# EasyEDA Pro project bldc-high-current-2-easyeda.epro, schematic Schematic1

## Sheets
1 power stage: Board Name: Board1; Create Date: 2025-10-15; Page Name: power stage; Project Name: bldc-high-current-2-easyeda; Schematic Name: Schematic1; Update Date: 2025-10-23; Company: EasyEDA.com; Page Size: A4; Version: V1.0
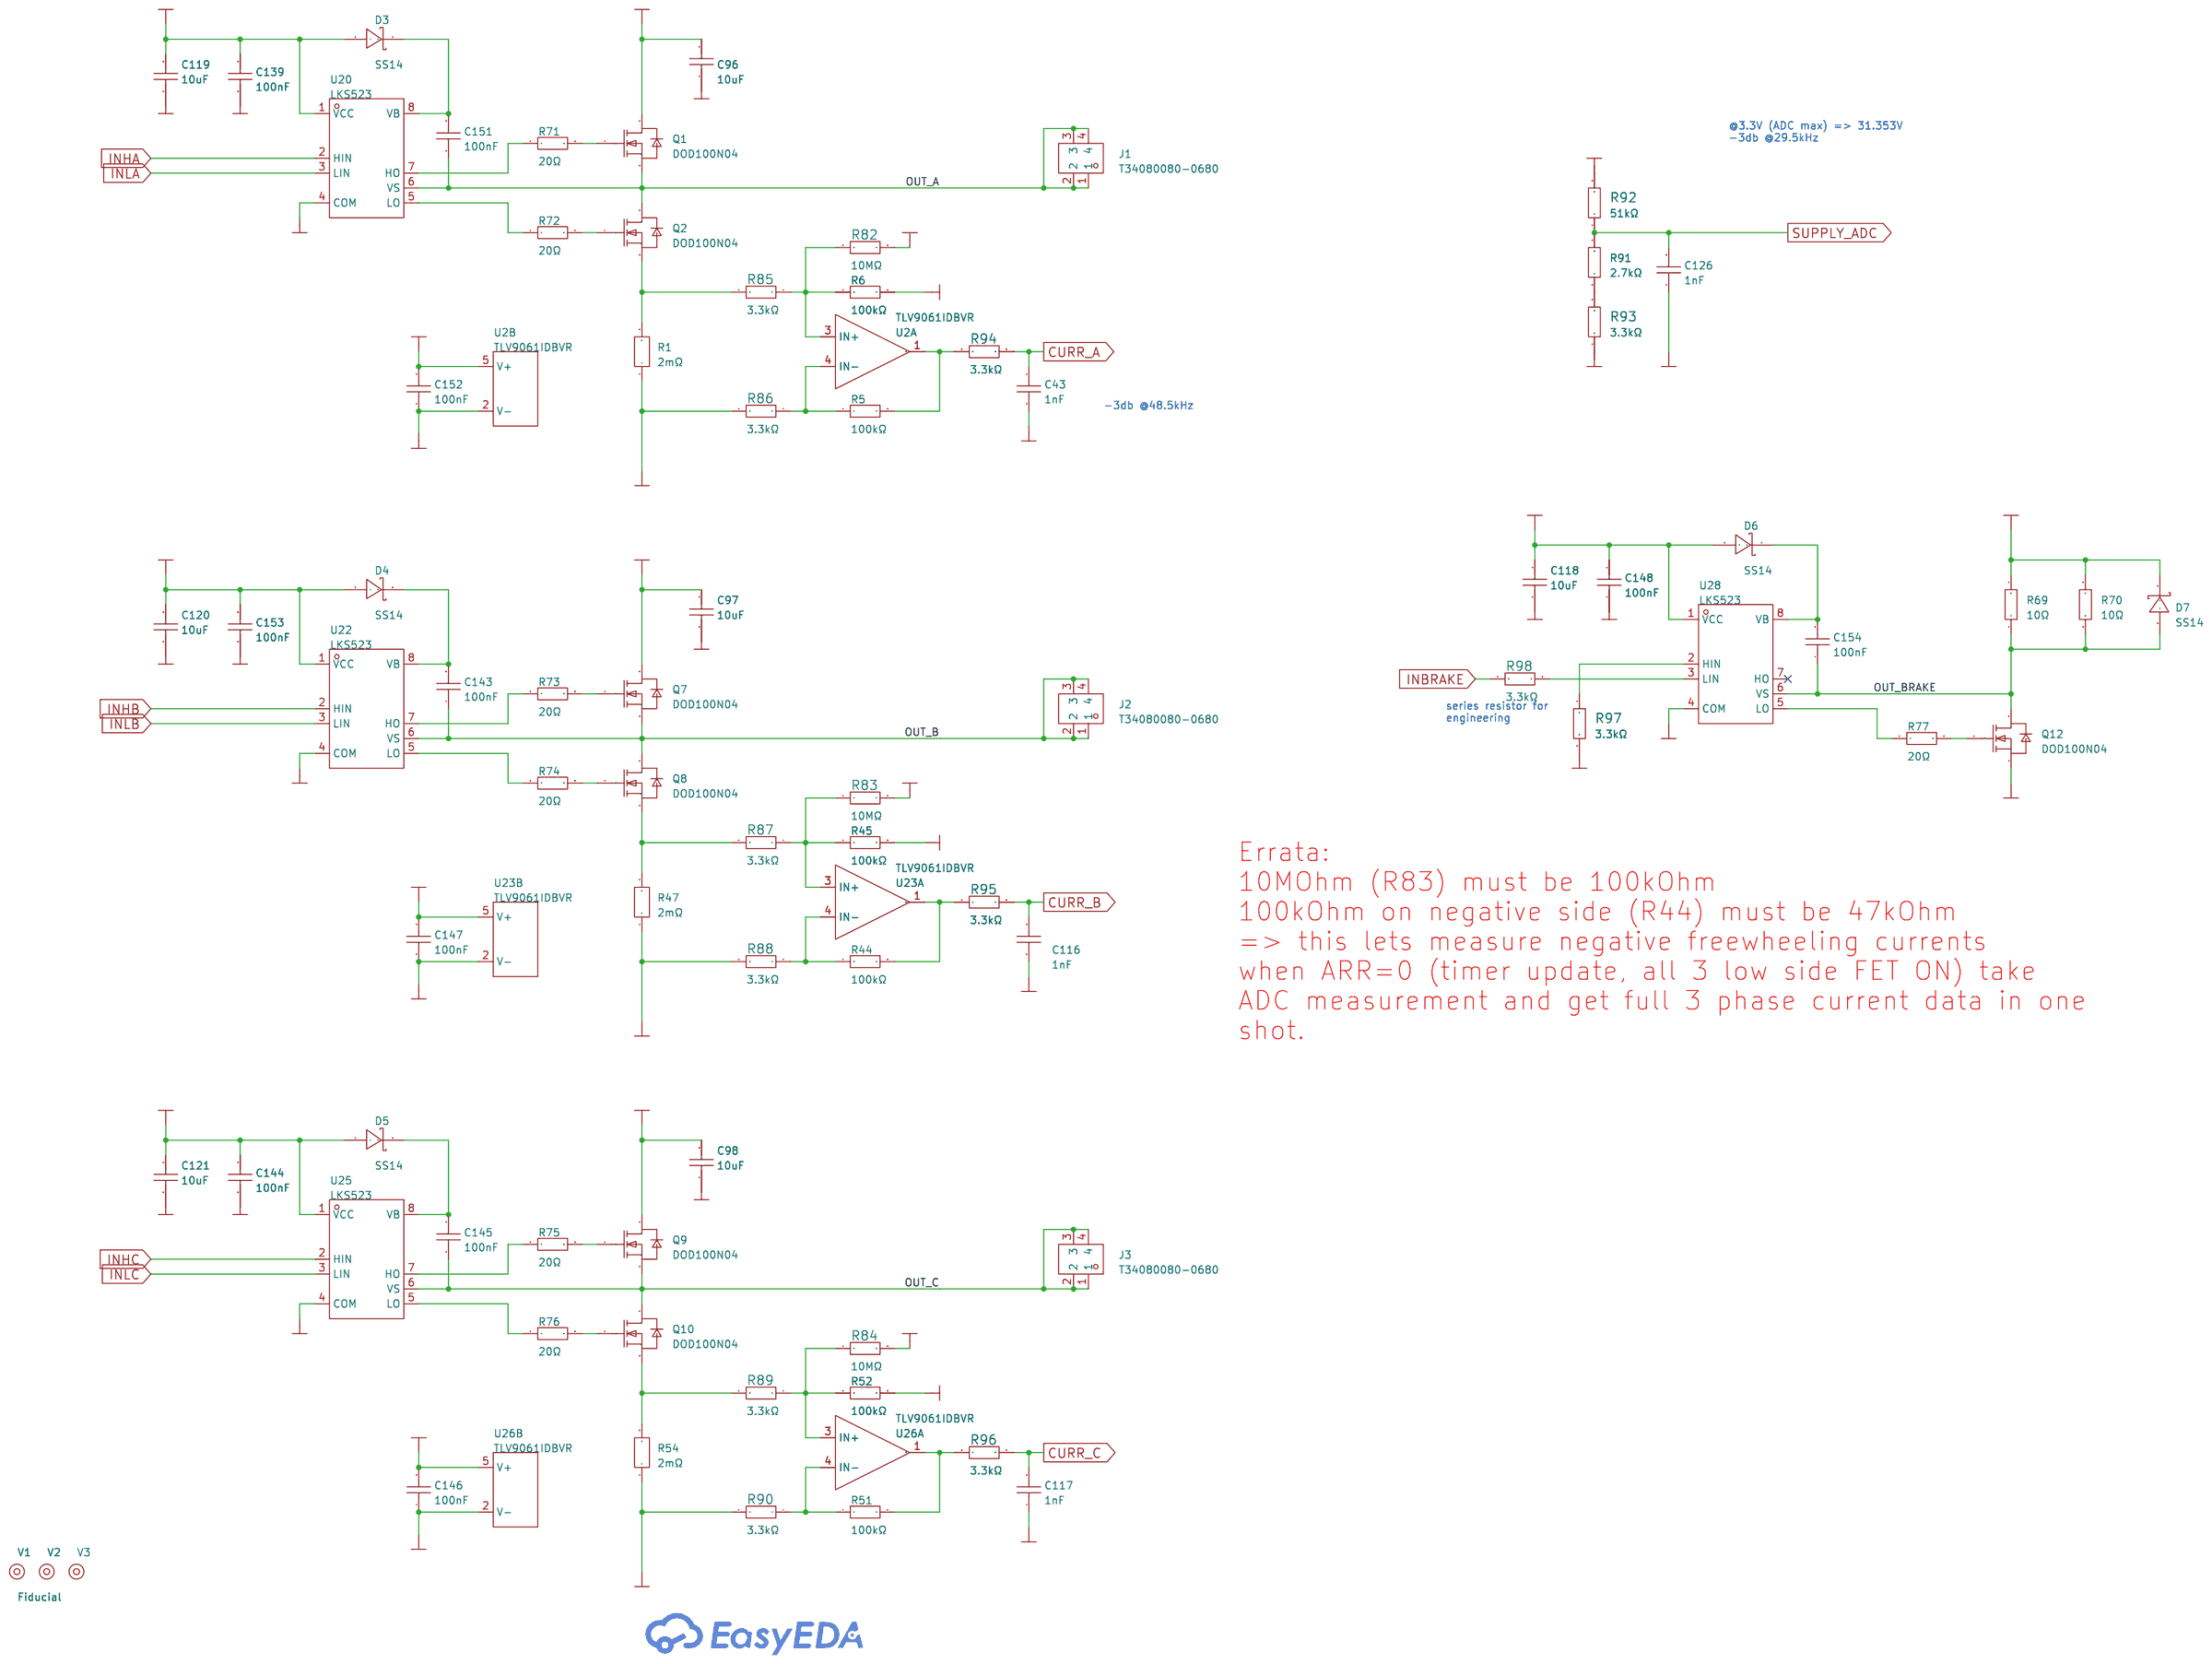
[diagram p0: power stage]
2 supply: Page Name: supply; Update Date: 2025-10-16
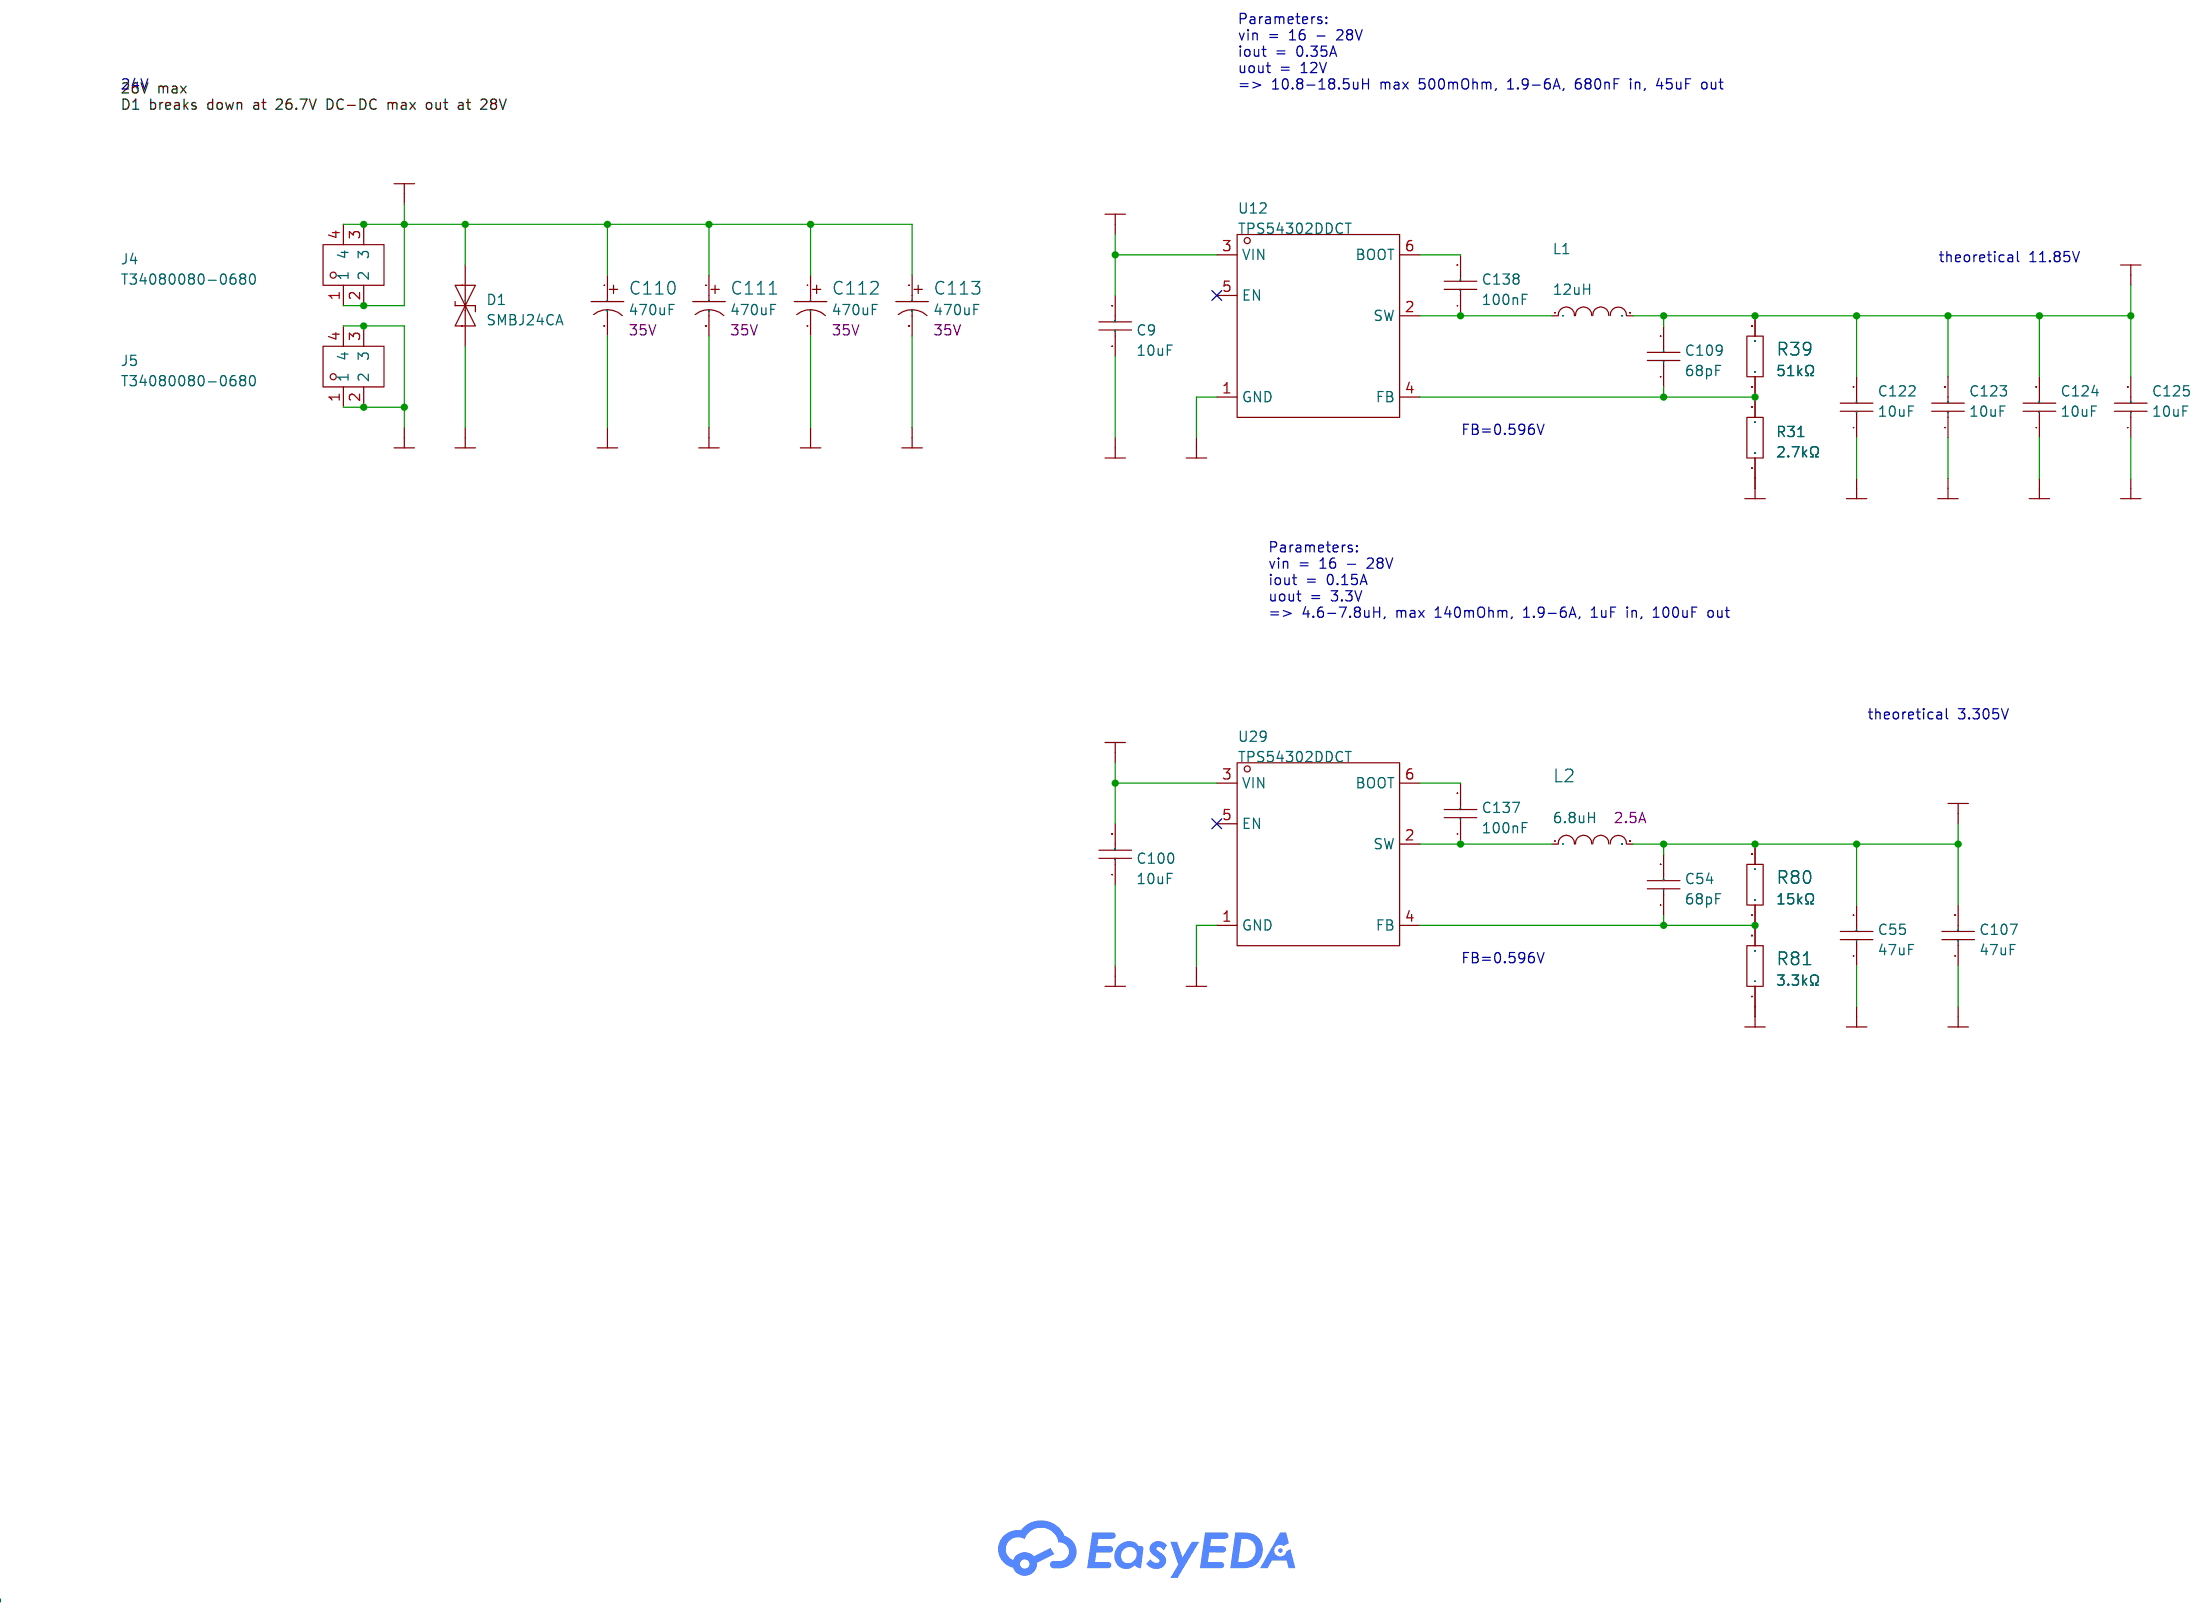
[diagram p1: supply]
3 controller: Page Name: controller; Update Date: 2025-10-16
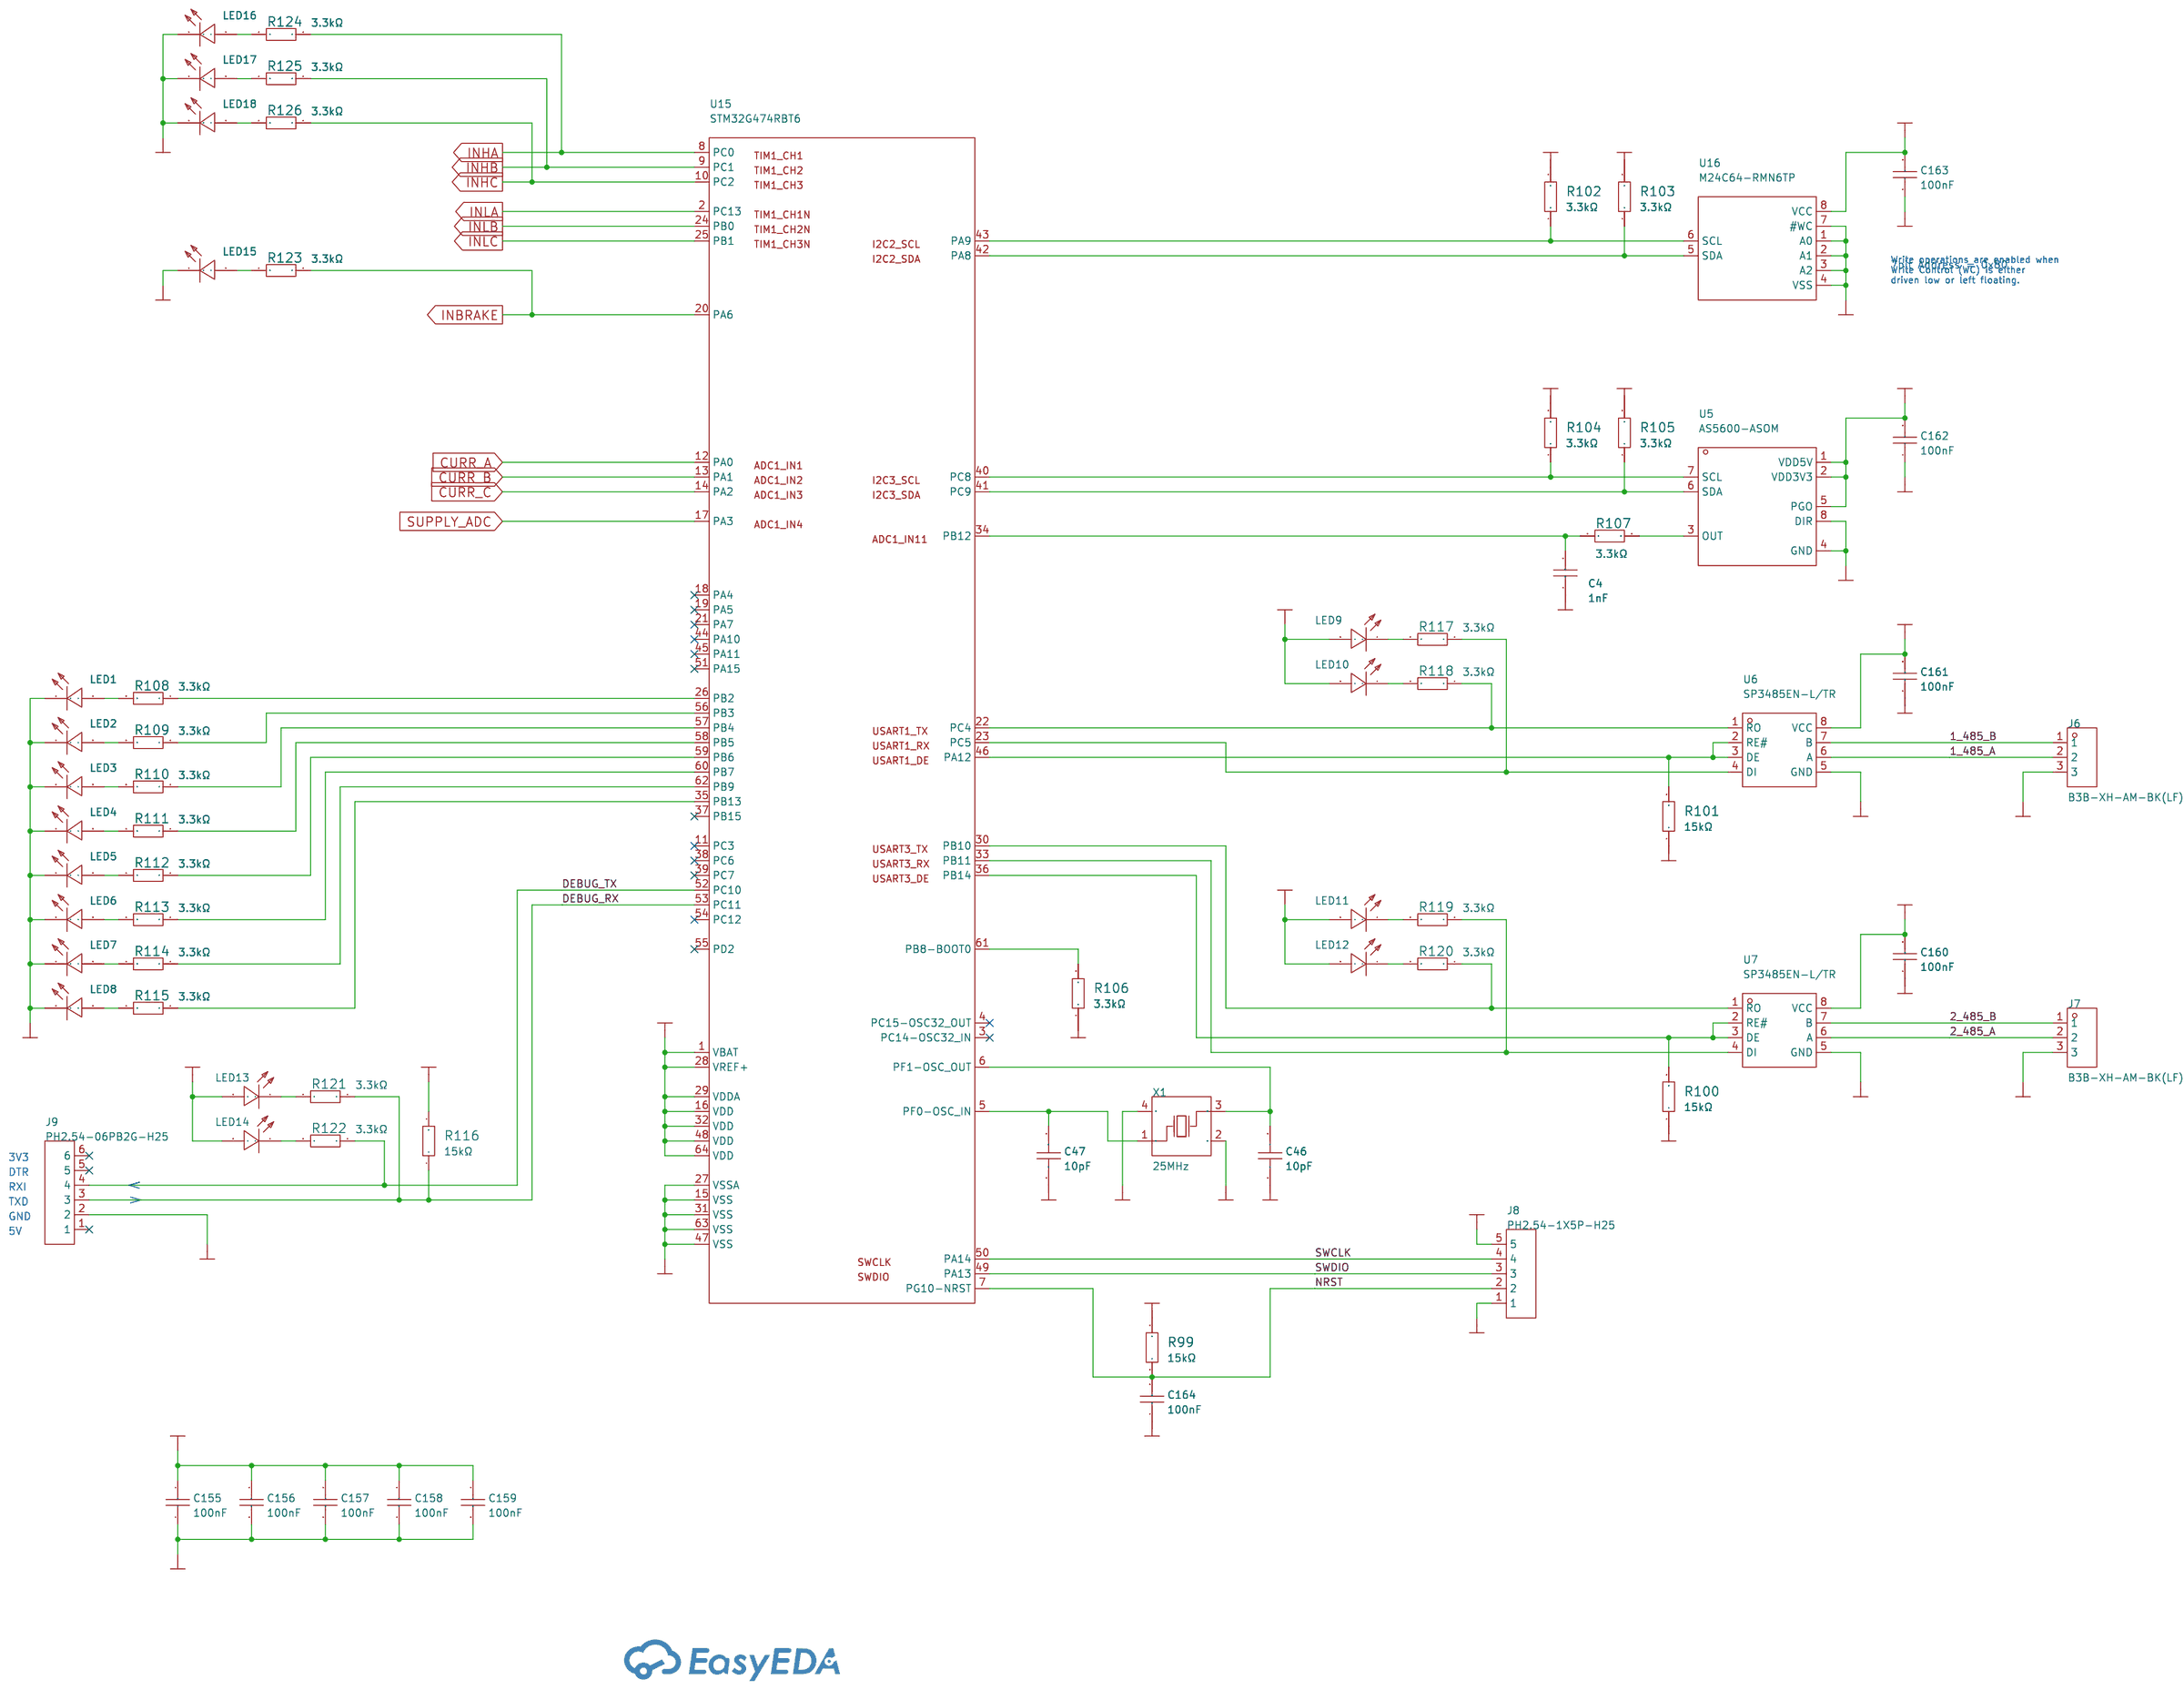
[diagram p2: controller]

## Parts
sheet controller
C4  1nF  [C0402]
C46  10pF  [C0402]
C47  10pF  [C0402]
C155  100nF  [C0402]
C156  100nF  [C0402]
C157  100nF  [C0402]
C158  100nF  [C0402]
C159  100nF  [C0402]
C160  100nF  [C0402]
C161  100nF  [C0402]
C162  100nF  [C0402]
C163  100nF  [C0402]
C164  100nF  [C0402]
J6  B3B-XH-AM-BK(LF)(SN)  [CONN-TH_B3B-XH-AM-BK-LF-SN]
J7  B3B-XH-AM-BK(LF)(SN)  [CONN-TH_B3B-XH-AM-BK-LF-SN]
J8  PH2.54-1X5P-H25  [HDR-TH_5P-P2.54-V-M-3]  (no BOM)
J9  PH2.54-06PB2G-H25  [HDR-TH_6P-P2.54-V-M_BLUE]  (no BOM)
LED1  KT-0603R  [LED0603-RD]
LED2  KT-0603R  [LED0603-RD]
LED3  KT-0603R  [LED0603-RD]
LED4  KT-0603R  [LED0603-RD]
LED5  KT-0603R  [LED0603-RD]
LED6  KT-0603R  [LED0603-RD]
LED7  KT-0603R  [LED0603-RD]
LED8  KT-0603R  [LED0603-RD]
LED9  KT-0603R  [LED0603-RD]
LED10  KT-0603R  [LED0603-RD]
LED11  KT-0603R  [LED0603-RD]
LED12  KT-0603R  [LED0603-RD]
LED13  KT-0603R  [LED0603-RD]
LED14  KT-0603R  [LED0603-RD]
LED15  KT-0603R  [LED0603-RD]
LED16  KT-0603R  [LED0603-RD]
LED17  KT-0603R  [LED0603-RD]
LED18  KT-0603R  [LED0603-RD]
R99  15kΩ  [R0402]
R100  15kΩ  [R0402]
R101  15kΩ  [R0402]
R102  3.3kΩ  [R0402]
R103  3.3kΩ  [R0402]
R104  3.3kΩ  [R0402]
R105  3.3kΩ  [R0402]
R106  3.3kΩ  [R0402]
R107  3.3kΩ  [R0402]
R108  3.3kΩ  [R0402]
R109  3.3kΩ  [R0402]
R110  3.3kΩ  [R0402]
R111  3.3kΩ  [R0402]
R112  3.3kΩ  [R0402]
R113  3.3kΩ  [R0402]
R114  3.3kΩ  [R0402]
R115  3.3kΩ  [R0402]
R116  15kΩ  [R0402]
R117  3.3kΩ  [R0402]
R118  3.3kΩ  [R0402]
R119  3.3kΩ  [R0402]
R120  3.3kΩ  [R0402]
R121  3.3kΩ  [R0402]
R122  3.3kΩ  [R0402]
R123  3.3kΩ  [R0402]
R124  3.3kΩ  [R0402]
R125  3.3kΩ  [R0402]
R126  3.3kΩ  [R0402]
U5  AS5600-ASOM  [SOIC-8_L5.0-W4.0-P1.27-LS6.0-BL]
U6  SP3485EN-L/TR  [SOIC-8_L5.0-W4.0-P1.27-LS6.0-BL]
U7  SP3485EN-L/TR  [SOIC-8_L5.0-W4.0-P1.27-LS6.0-BL]
U15  STM32G474RBT6  [LQFP-64_L10.0-W10.0-P0.50-LS12.0-BL]
U16  M24C64-RMN6TP  [SOIC-8_L5.0-W4.0-P1.27-LS6.0-BL]
X1  25MHz  [CRYSTAL-SMD_4P-L3.2-W2.5-BL]
sheet power stage
C43  1nF  [C0402]
C96  10uF  [C1206]
C97  10uF  [C1206]
C98  10uF  [C1206]
C116  1nF  [C0402]
C117  1nF  [C0402]
C118  10uF  [C0805]
C119  10uF  [C0805]
C120  10uF  [C0805]
C121  10uF  [C0805]
C126  1nF  [C0402]
C139  100nF  [C0402]
C143  100nF  [C0402]
C144  100nF  [C0402]
C145  100nF  [C0402]
C146  100nF  [C0402]
C147  100nF  [C0402]
C148  100nF  [C0402]
C151  100nF  [C0402]
C152  100nF  [C0402]
C153  100nF  [C0402]
C154  100nF  [C0402]
D3  SS14  [SMA_L4.2-W2.6-LS5.0-RD_1]
D4  SS14  [SMA_L4.2-W2.6-LS5.0-RD_1]
D5  SS14  [SMA_L4.2-W2.6-LS5.0-RD_1]
D6  SS14  [SMA_L4.2-W2.6-LS5.0-RD_1]
D7  SS14  [SMA_L4.2-W2.6-LS5.0-RD_1]
J1  T34080080-0680  [CONN-TH_T34080080-0680]
J2  T34080080-0680  [CONN-TH_T34080080-0680]
J3  T34080080-0680  [CONN-TH_T34080080-0680]
Q1  DOD100N04  [TO-252-2_L6.6-W6.2-P4.57-LS10.1-BR-CW]
Q2  DOD100N04  [TO-252-2_L6.6-W6.2-P4.57-LS10.1-BR-CW]
Q7  DOD100N04  [TO-252-2_L6.6-W6.2-P4.57-LS10.1-BR-CW]
Q8  DOD100N04  [TO-252-2_L6.6-W6.2-P4.57-LS10.1-BR-CW]
Q9  DOD100N04  [TO-252-2_L6.6-W6.2-P4.57-LS10.1-BR-CW]
Q10  DOD100N04  [TO-252-2_L6.6-W6.2-P4.57-LS10.1-BR-CW]
Q12  DOD100N04  [TO-252-2_L6.6-W6.2-P4.57-LS10.1-BR-CW]
R1  2mΩ  [RES-SMD_L6.4-W3.2-1]
R5  100kΩ  [R0603]
R6  100kΩ  [R0603]
R44  100kΩ  [R0603]
R45  100kΩ  [R0603]
R47  2mΩ  [RES-SMD_L6.4-W3.2-1]
R51  100kΩ  [R0603]
R52  100kΩ  [R0603]
R54  2mΩ  [RES-SMD_L6.4-W3.2-1]
R69  10Ω  [RES-TH_BD8.0-L24.5-P28.50-D0.8]
R70  10Ω  [RES-TH_BD8.0-L24.5-P28.50-D0.8]
R71  20Ω  [R0805]
R72  20Ω  [R0805]
R73  20Ω  [R0805]
R74  20Ω  [R0805]
R75  20Ω  [R0805]
R76  20Ω  [R0805]
R77  20Ω  [R0805]
R82  10MΩ  [R0603]
R83  10MΩ  [R0603]
R84  10MΩ  [R0603]
R85  3.3kΩ  [R0402]
R86  3.3kΩ  [R0402]
R87  3.3kΩ  [R0402]
R88  3.3kΩ  [R0402]
R89  3.3kΩ  [R0402]
R90  3.3kΩ  [R0402]
R91  2.7kΩ  [R0603]
R92  51kΩ  [R0402]
R93  3.3kΩ  [R0402]
R94  3.3kΩ  [R0402]
R95  3.3kΩ  [R0402]
R96  3.3kΩ  [R0402]
R97  3.3kΩ  [R0402]
R98  3.3kΩ  [R0402]
U2  TLV9061IDBVR  [SOT-23-5_L3.0-W1.7-P0.95-LS2.8-BL]  (sections 1,2)
U20  LKS523  [SOP-8_L4.9-W3.9-P1.27-LS6.0-BL]
U22  LKS523  [SOP-8_L4.9-W3.9-P1.27-LS6.0-BL]
U23  TLV9061IDBVR  [SOT-23-5_L3.0-W1.7-P0.95-LS2.8-BL]  (sections 1,2)
U25  LKS523  [SOP-8_L4.9-W3.9-P1.27-LS6.0-BL]
U26  TLV9061IDBVR  [SOT-23-5_L3.0-W1.7-P0.95-LS2.8-BL]  (sections 1,2)
U28  LKS523  [SOP-8_L4.9-W3.9-P1.27-LS6.0-BL]
V1  Fiducial  [Fiducial:Fiducial_0.5mm_Mask1mm]  (no BOM)
V2  Fiducial  [Fiducial:Fiducial_0.5mm_Mask1mm]  (no BOM)
V3  Fiducial  [Fiducial:Fiducial_0.5mm_Mask1mm]  (no BOM)
sheet supply
C9  10uF  [C1206]
C54  68pF  [C0603]
C55  47uF  [C0805]
C100  10uF  [C1206]
C107  47uF  [C0805]
C109  68pF  [C0603]
C110  470uF  [CAP-SMD_BD10.0-L10.3-W10.3-FD]
C111  470uF  [CAP-SMD_BD10.0-L10.3-W10.3-FD]
C112  470uF  [CAP-SMD_BD10.0-L10.3-W10.3-FD]
C113  470uF  [CAP-SMD_BD10.0-L10.3-W10.3-FD]
C122  10uF  [C0805]
C123  10uF  [C0805]
C124  10uF  [C0805]
C125  10uF  [C0805]
C137  100nF  [C0402]
C138  100nF  [C0402]
D1  SMBJ24CA  [SMB_L4.6-W3.6-LS5.3-BI]
J4  T34080080-0680  [CONN-TH_T34080080-0680]
J5  T34080080-0680  [CONN-TH_T34080080-0680]
L1  12uH  [IND-SMD_L6.0-W6.0_SWPA6045S]
L2  6.8uH  [IND-SMD_L5.0-W5.0_SWPA5040S]
R31  2.7kΩ  [R0603]
R39  51kΩ  [R0402]
R80  15kΩ  [R0402]
R81  3.3kΩ  [R0402]
U12  TPS54302DDCT  [TSOT-23-6_L2.9-W1.6-P0.95-LS2.8-BR]
U29  TPS54302DDCT  [TSOT-23-6_L2.9-W1.6-P0.95-LS2.8-BR]

## Library data of the parts
C4 C43 C116 C117 C126 = 0402B102K500NT: Capacitance:1nF Tolerance:±10% Tolerance:±10% Voltage Rating:50V Temperature Coefficient:X7R; LCSC Part Name: 1nF ±10% 50V; Supplier Part: C1523; Manufacturer: FH(风华); Supplier Footprint: 0402; JLCPCB Part Class: Basic Part; Datasheet: https://item.szlcsc.com/datasheet/0402B102K500NT/1875.html; Supplier: LCSC; Tolerance: ±10%; Voltage Rating: 50V; Temperature Coefficient: X7R
C46 C47 = CL05C100JB5NNNC: Capacitance:10pF Tolerance:±5% Tolerance:±5% Voltage Rating:50V Temperature Coefficient:C0G; LCSC Part Name: 10pF ±5% 50V; Supplier Part: C32949; Manufacturer: SAMSUNG(三星); Supplier Footprint: 0402; JLCPCB Part Class: Basic Part; Datasheet: https://item.szlcsc.com/datasheet/CL05C100JB5NNNC/33914.html; Supplier: LCSC; Tolerance: ±5%; Voltage Rating: 50V; Temperature Coefficient: C0G
C137-C139 C143-C148 C151-C164 = CL05B104KB54PNC: Capacitance:100nF Tolerance:±10% Tolerance:±10% Voltage Rating:50V Temperature Coefficient:X7R; LCSC Part Name: 100nF ±10% 50V; Supplier Part: C307331; Manufacturer: SAMSUNG(三星); Supplier Footprint: 0402; JLCPCB Part Class: Basic Part; Datasheet: https://item.szlcsc.com/datasheet/CL05B104KB54PNC/291005.html; Supplier: LCSC; Tolerance: ±10%; Voltage Rating: 50V; Temperature Coefficient: X7R
J6 J7 = B3B-XH-AM-BK(LF)(SN): Pins Structure:1x3P Pitch:2.5mm Mounting Style:Direct Insert Reference Series:XH Number of Pins:3P Number of Rows:1 Number of PINs Per Row:3 Row Spacing:- Current Rating (Max):3A Contact Material:Brass Contact Plating:Tin Operating Temperature Range:-25℃~; LCSC Part Name: 1x3P 间距:2.5mm 直插 系列:XH; Supplier Part: C565985; Manufacturer: JST; Supplier Footprint: 插件,P=2.5mm; JLCPCB Part Class: Extended Part; Datasheet: https://atta.szlcsc.com/upload/public/pdf/source/20200721/C565985_379C4E6280E7DEEA62EFDBC1DBEF32A6.pdf; Supplier: LCSC; Pins Structure: 1x3P; Pitch: 2.5mm; Mounting Style: Direct Insert; Reference Series: XH; Number of Pins: 3P; Number of Rows: 1; Number of PINs Per Row: 3; Current Rating (Max): 3A; Contact Material: Brass; Contact Plating: Tin; Operating Temperature Range: -25℃~+85℃; Rated Voltage (Max): 250V; Plastic Material: PA66; Flame Retardant Rating: UL94V-0; Supplementary Features: With column；K-leg punch; Colour: Black; Z-Height of the Board: 7mm; X-Length of Bottom Edge on Board (Spacing Line): 9.9mm; Y-Width of Bottom Edge on Board: 5.75mm
J8 = PH2.54-1X5P-H25: Pin Structure:1x5P Pitch:2.54mm Row Spacing:- Circluar Pins/Square Pins:Pin Header Mounting Type:Through Hole Number of Rows:1 Number of Pins:5P Current Rating:3A Voltage Rating (Max):- Length of Mating Pin:6mm Insulation Height:2.5mm Length of End Connec; LCSC Part Name: 1x5P 间距:2.54mm 方针 直插; Supplier Part: C42431835; Manufacturer: JXTCONN(聚兴泰); Supplier Footprint: 插件,P=2.54mm; JLCPCB Part Class: Extended Part; Datasheet: https://item.szlcsc.com/datasheet/PH2.54-1X5P-H25/44458965.html; Supplier: LCSC; Pin Structure: 1x5P; Pitch: 2.54mm; Circluar Pins/Square Pins: Pin Header; Mounting Type: Through Hole; Number of Rows: 1; Number of Pins: 5P; Current Rating: 3A; Length of Mating Pin: 6mm; Insulation Height: 2.5mm; Length of End Connection Pin: 3mm; Contact Material: Brass; Contact Plating: Gold; Operating Temperature: -40℃~+105℃; Color: Black
J9 = PH2.54-06PB2G-H25: Pin Structure:1x6P Pitch:2.54mm Row Spacing:- Circluar Pins/Square Pins:Pin Header Mounting Type:Through Hole Number of Rows:1 Number of Pins:6P Current Rating:3A Voltage Rating (Max):- Length of Mating Pin:6mm Insulation Height:2.5mm Length of End Connec; LCSC Part Name: 1x6P 间距:2.54mm 方针 直插; Supplier Part: C42431807; Manufacturer: JXTCONN(聚兴泰); Supplier Footprint: 插件,P=2.54mm; JLCPCB Part Class: Extended Part; Datasheet: https://item.szlcsc.com/datasheet/PH2.54-06PB2G-H25/44458937.html; Supplier: LCSC; Pin Structure: 1x6P; Pitch: 2.54mm; Circluar Pins/Square Pins: Pin Header; Mounting Type: Through Hole; Number of Rows: 1; Number of Pins: 6P; Current Rating: 3A; Length of Mating Pin: 6mm; Insulation Height: 2.5mm; Length of End Connection Pin: 3mm; Contact Material: Brass; Contact Plating: Gold; Operating Temperature: -40℃~+105℃; Color: Black
LED1-LED18 = KT-0603R: Emitted Color:Red Power Dissipation:- Forward Current:- Dominant Wavelength:- Dominant Wavelength:- Peak Wavelength:- Diode Configuration:- Lens Color:- Color Temperature:- Color Temperature:- Viewing Angle:- Mounting Sytle:- Operating Temperature:-40℃~+8; LCSC Part Name: 0603 红灯 高亮; Supplier Part: C2286; Manufacturer: KENTO; Supplier Footprint: 0603; JLCPCB Part Class: Basic Part; Datasheet: https://atta.szlcsc.com/upload/public/pdf/source/20160616/1466072038404.pdf; Supplier: LCSC; Emitted Color: Red; Operating Temperature: -40℃~+85℃
R80 R99-R101 R116 = 0402WGF1502TCE: Type:Thick Film Resistors Resistance:15kΩ Tolerance:±1% Tolerance:±1% Power(Watts): Overload Voltage (Max): Temperature Coefficient:±100ppm/℃ Temperature Coefficient:±100ppm/℃ Operating Temperature Range:-55℃~+155℃ Operating Temperature Range:-55℃~+155℃; LCSC Part Name: 15kΩ ±1% 62.5mW 厚膜电阻; Supplier Part: C25756; Manufacturer: UNI-ROYAL(厚声); Supplier Footprint: 0402; JLCPCB Part Class: Basic Part; Datasheet: https://atta.szlcsc.com/upload/public/pdf/source/20200306/C422600_1E6D84923E4A46A82E41ADD87F860B5C.pdf; Supplier: LCSC; Type: Thick Film Resistors; Tolerance: ±1%; Temperature Coefficient: ±100ppm/℃; Operating Temperature Range: -55℃~+155℃
R81 R85-R90 R93-R98 R102-R115 R117-R126 = 0402WGF3301TCE: Type:Thick Film Resistor Resistance:3.3kΩ Tolerance:±1% Tolerance:±1% Power(Watts):62.5mW Voltage-Supply(Max):50V Temperature Coefficient:±100ppm/℃ Temperature Coefficient:±100ppm/℃ Operating Temperature:-55℃~+155℃ Operating Temperature:-55℃~+155℃; LCSC Part Name: 3.3kΩ ±1% 62.5mW 厚膜电阻; Supplier Part: C25890; Manufacturer: UNI-ROYAL(厚声); Supplier Footprint: 0402; JLCPCB Part Class: Basic Part; Datasheet: https://item.szlcsc.com/datasheet/0402WGF3301TCE/26633.html; Supplier: LCSC; Type: Thick Film Resistor; Tolerance: ±1%; Power(Watts): 62.5mW; Voltage-Supply(Max): 50V; Temperature Coefficient: ±100ppm/℃; Operating Temperature: -55℃~+155℃
U5 = AS5600-ASOM: Supply Voltage:5V；3.3V Supply Voltage:5V；3.3V Rotation Angle:0°~360° Rotation Angle:0°~360°; Supplier Part: C79815; Manufacturer: ams(艾迈斯半导体); Supplier Footprint: SOIC-8; JLCPCB Part Class: Extended Part; Datasheet: https://atta.szlcsc.com/upload/public/pdf/source/20161027/1477535527192.pdf; Supplier: LCSC; Supply Voltage: 5V；3.3V; Rotation Angle: 0°~360°
U6 U7 = SP3485EN-L/TR: Types:Transceiver Number of Driver:1 Number of receiver:1 Supply Voltage:3.3V Supply Voltage:3.3V Data Rate:10Mbps Data Rate:10Mbps Operating Temperature:-40℃~+85℃ Operating Temperature:-40℃~+85℃; LCSC Part Name: SP3485 +3.3V低功耗半双工RS-485收发器，数据速率10Mbps; Supplier Part: C8963; Manufacturer: MaxLinear(迈凌); Supplier Footprint: SOIC-8; JLCPCB Part Class: Basic Part; Datasheet: https://atta.szlcsc.com/upload/public/pdf/source/20170601/1496285796963.pdf; Supplier: LCSC; Types: Transceiver; Number of Driver: 1; Number of receiver: 1; Supply Voltage: 3.3V; Data Rate: 10Mbps; Operating Temperature: -40℃~+85℃
U15 = STM32G474RBT6: CPU Core:ARM-M4 CPU Maximum Speed:170MHz Program Storage Size:128KB Program Memory Type:FLASH Number of I/O:52 ADC (Bit):12bit DAC (Bit):12bit Voltage - Supply:1.71V~3.6V Voltage - Supply:1.71V~3.6V Applications:-; LCSC Part Name: 带DSP和FPU的170MHz主流ARM Cortex-M4 MCU，具有128 KB Flash存储器、数学加速器、高分辨率定时器和高模拟电平集成; Supplier Part: C529413; Manufacturer: ST(意法半导体); Supplier Footprint: LQFP-64(10x10); JLCPCB Part Class: Extended Part; Datasheet: https://item.szlcsc.com/datasheet/STM32G474RBT6/549641.html; Supplier: LCSC; CPU Core: ARM-M4; CPU Maximum Speed: 170MHz; Program Storage Size: 128KB; Program Memory Type: FLASH; Number of I/O: 52; ADC (Bit): 12bit; DAC (Bit): 12bit; Voltage - Supply: 1.71V~3.6V
U16 = M24C64-RMN6TP: Interface:I2C Memory Size:64Kbit Clock Frequency:1MHz Clock Frequency:1MHz Voltage - Supply:1.8V~5.5V Voltage - Supply:1.8V~5.5V Write Cycle Time(Tw):5ms Data Retention - TDR (Year):200 Year Write Cycle Endurance:4,000,000 Cycles Operating Temperature:-40; LCSC Part Name: 64 Kbit串行I2C总线EEPROM; Supplier Part: C79988; Manufacturer: ST(意法半导体); Supplier Footprint: SOIC-8; JLCPCB Part Class: Extended Part; Datasheet: https://item.szlcsc.com/datasheet/M24C64-RMN6TP/81133.html; Supplier: LCSC; Interface: I2C; Memory Size: 64Kbit; Clock Frequency: 1MHz; Voltage - Supply: 1.8V~5.5V; Write Cycle Time(Tw): 5ms; Data Retention - TDR (Year): 200 Year; Write Cycle Endurance: 4,000,000 Cycles; Operating Temperature: -40℃~+85℃
X1 = X322525MOB4SI: Type:Surface Mount Crystal Frequency:25MHz Normal temperature Frequency Tolerance:±10ppm Normal temperature Frequency Tolerance:±10ppm Load Capacitance:12pF Frequency Stability:±20ppm Frequency Stability:±20ppm Operating Temperature:-40℃~+85℃ Operating Te; LCSC Part Name: YSX321SL 25MHZ 4P 3225 12PF ±10PPM -40~85℃ (±20PPM); Supplier Part: C9006; Manufacturer: YXC(扬兴晶振); Supplier Footprint: SMD3225-4P; JLCPCB Part Class: Basic Part; Datasheet: https://item.szlcsc.com/datasheet/X322525MOB4SI/9526.html; Supplier: LCSC; Type: Surface Mount Crystal; Normal temperature Frequency Tolerance: ±10ppm; Load Capacitance: 12pF; Frequency Stability: ±20ppm; Operating Temperature: -40℃~+85℃
C9 C96-C98 C100 = CL31A106KBHNNNE: Capacitance:10uF Tolerance:±10% Tolerance:±10% Voltage Rating:50V Temperature Coefficient:X5R; LCSC Part Name: 10uF ±10% 50V; Supplier Part: C13585; Manufacturer: SAMSUNG(三星); Supplier Footprint: 1206; JLCPCB Part Class: Basic Part; Datasheet: https://item.szlcsc.com/datasheet/CL31A106KBHNNNE/14236.html; Supplier: LCSC; Tolerance: ±10%; Voltage Rating: 50V; Temperature Coefficient: X5R
C118-C125 = CL21A106KAYNNNE_C15850: Capacitance:10uF Tolerance:±10% Tolerance:±10% Voltage Rating:25V Temperature Coefficient:X5R; LCSC Part Name: 10uF ±10% 25V; Supplier Part: C15850; Manufacturer: SAMSUNG(三星); Manufacturer Part: CL21A106KAYNNNE; Supplier Footprint: 0805; JLCPCB Part Class: Basic Part; Datasheet: https://item.szlcsc.com/datasheet/CL21A106KAYNNNE/16532.html; Supplier: LCSC; Tolerance: ±10%; Voltage Rating: 25V; Temperature Coefficient: X5R
D3-D7 = SS14_C2480: Diode Configuration:Independent Voltage - Forward(Vf@If):550mV@1A Voltage - DC Reverse(Vr):40V Current - Rectified:1A Reverse Leakage Current (Ir):300uA@40V Operating Junction Temperature Range:-55℃~+150℃ Operating Junction Temperature Range:-55℃~+150℃ No; LCSC Part Name: 电压:40V 电流:1A; Supplier Part: C2480; Manufacturer: MDD(辰达半导体); Supplier Footprint: SMA(DO-214AC); JLCPCB Part Class: Basic Part; Datasheet: https://item.szlcsc.com/datasheet/SS14/2857.html; Supplier: LCSC; Diode Configuration: Independent; Voltage - Forward(Vf@If): 550mV@1A; Voltage - DC Reverse(Vr): 40V; Current - Rectified: 1A; Reverse Leakage Current (Ir): 300uA@40V; Operating Junction Temperature Range: -55℃~+150℃; Non-Repetitive Peak Forward Surge Current: 25A
J1-J5 = T34080080-0680: Screw Hole Size:M3 Number of Leg:4; LCSC Part Name: PCB焊接端子抽牙M3 四脚 8.0*8.0*6.8mm T0.8 镀雾锡; Supplier Part: C19724524; Manufacturer: XFCN(兴飞); Supplier Footprint: 插件; JLCPCB Part Class: Extended Part; Datasheet: https://item.szlcsc.com/datasheet/T34080080-0680/21043623.html; Supplier: LCSC; Screw Hole Size: M3; Number of Leg: 4
Q1 Q2 Q7-Q10 Q12 = DOD100N04: Number:1 N-Channel Drain to Source Voltage:40V Current - Continuous Drain(Id):100A RDS(on):5.5mΩ@10V Pd - Power Dissipation:142W Gate Threshold Voltage (Vgs(th)):2.5V@250uA Gate Charge(Qg):14nC@10V Input Capacitance(Ciss):3.777nF Reverse Transfer Capacita; LCSC Part Name: 1个N沟道 耐压:40V 电流:100A; Supplier Part: C42374600; Manufacturer: DOINGTER(杜因特); Supplier Footprint: TO-252; JLCPCB Part Class: Extended Part; Datasheet: https://item.szlcsc.com/datasheet/DOD100N04/44260712.html; Supplier: LCSC; Number: 1 N-Channel; Drain to Source Voltage: 40V; Current - Continuous Drain(Id): 100A; RDS(on): 5.5mΩ@10V; Pd - Power Dissipation: 142W; Gate Threshold Voltage (Vgs(th)): 2.5V@250uA; Gate Charge(Qg): 14nC@10V; Input Capacitance(Ciss): 3.777nF; Reverse Transfer Capacitance (Crss@Vds): 223pF; Operating Temperature: -55℃~+150℃; Type: N-Channel; Output Capacitance(Coss): 266pF
R1 R47 R54 = HoLLR2512-3W-2mR-1%: Type:Current Sensing Resistors Resistance:2mΩ Tolerance:±1% Tolerance:±1% Rated Output Voltage:- Power(Watts): Rated Current:77.5A Temperature Coefficient:±50ppm/℃ Temperature Coefficient:±50ppm/℃ Mounting Sytle:Surface Mount; LCSC Part Name: 2mΩ ±1% 3W; Supplier Part: C2994640; Manufacturer: Milliohm(毫欧); Supplier Footprint: 2512; JLCPCB Part Class: Extended Part; Datasheet: https://atta.szlcsc.com/upload/public/pdf/source/20220330/9E8D3880B1628B3B70C68092C8A7E08B.pdf; Supplier: LCSC; Type: Current Sensing Resistors; Tolerance: ±1%; Rated Current: 77.5A; Temperature Coefficient: ±50ppm/℃; Mounting Sytle: Surface Mount
R5 R6 R44 R45 R51 R52 = 0603WAF1003T5E: Type:Thick Film Resistor Resistance:100kΩ Tolerance:±1% Tolerance:±1% Power(Watts):100mW Voltage-Supply(Max):75V Temperature Coefficient:±100ppm/℃ Temperature Coefficient:±100ppm/℃ Operating Temperature:-55℃~+155℃ Operating Temperature:-55℃~+155℃; LCSC Part Name: 100kΩ ±1% 100mW 厚膜电阻; Supplier Part: C25803; Manufacturer: UNI-ROYAL(厚声); Supplier Footprint: 0603; JLCPCB Part Class: Basic Part; Datasheet: https://item.szlcsc.com/datasheet/0603WAF1003T5E/26546.html; Supplier: LCSC; Type: Thick Film Resistor; Tolerance: ±1%; Power(Watts): 100mW; Voltage-Supply(Max): 75V; Temperature Coefficient: ±100ppm/℃; Operating Temperature: -55℃~+155℃
R69 R70 = KNP5W-10Ω±5% T: Type:Wirewound Resistors Resistance: Tolerance:±5% Tolerance:±5% Overload Voltage (Max): Power(Watts):5W Temperature Coefficient:±350ppm/℃ Temperature Coefficient:±350ppm/℃ Operating Temperature Range:-55℃~+255℃ Operating Temperature Range:-55℃~+255℃; LCSC Part Name: 10Ω ±5% 5W 绕线电阻; Supplier Part: C136506; Manufacturer: CCO(千志电子); Supplier Footprint: 插件,D8xL24.5mm; JLCPCB Part Class: Extended Part; Datasheet: https://atta.szlcsc.com/upload/public/pdf/source/20190107/C359999_B5A95D37D923ECE8400EED363D9E93EF.pdf; Supplier: LCSC; Type: Wirewound Resistors; Tolerance: ±5%; Power(Watts): 5W; Temperature Coefficient: ±350ppm/℃; Operating Temperature Range: -55℃~+255℃
R71-R77 = 0805W8F200JT5E: Type:Thick Film Resistor Resistance:20Ω Tolerance:±1% Tolerance:±1% Power(Watts):125mW Voltage-Supply(Max):150V Temperature Coefficient:±100ppm/℃ Temperature Coefficient:±100ppm/℃ Operating Temperature:-55℃~+155℃ Operating Temperature:-55℃~+155℃; LCSC Part Name: 20Ω ±1% 125mW 厚膜电阻; Supplier Part: C17544; Manufacturer: UNI-ROYAL(厚声); Supplier Footprint: 0805; JLCPCB Part Class: Basic Part; Datasheet: https://item.szlcsc.com/datasheet/0805W8F200JT5E/18232.html; Supplier: LCSC; Type: Thick Film Resistor; Tolerance: ±1%; Power(Watts): 125mW; Voltage-Supply(Max): 150V; Temperature Coefficient: ±100ppm/℃; Operating Temperature: -55℃~+155℃
R82-R84 = 0603WAF1005T5E: Type:Thick Film Resistors Resistance:10MΩ Tolerance:±1% Tolerance:±1% Power(Watts): Overload Voltage (Max): Temperature Coefficient:±100ppm/℃ Temperature Coefficient:±100ppm/℃ Operating Temperature Range:-55℃~+155℃ Operating Temperature Range:-55℃~+155℃; LCSC Part Name: 10MΩ ±1% 100mW 厚膜电阻; Supplier Part: C7250; Manufacturer: UNI-ROYAL(厚声); Supplier Footprint: 0603; JLCPCB Part Class: Basic Part; Datasheet: https://atta.szlcsc.com/upload/public/pdf/source/20200306/C422600_1E6D84923E4A46A82E41ADD87F860B5C.pdf; Supplier: LCSC; Type: Thick Film Resistors; Tolerance: ±1%; Temperature Coefficient: ±100ppm/℃; Operating Temperature Range: -55℃~+155℃
R31 R91 = 0603WAF2701T5E: Type:Thick Film Resistor Resistance:2.7kΩ Tolerance:±1% Tolerance:±1% Power(Watts):100mW Voltage-Supply(Max):75V Temperature Coefficient:±100ppm/℃ Temperature Coefficient:±100ppm/℃ Operating Temperature:-55℃~+155℃ Operating Temperature:-55℃~+155℃; LCSC Part Name: 2.7kΩ ±1% 100mW 厚膜电阻; Supplier Part: C13167; Manufacturer: UNI-ROYAL(厚声); Supplier Footprint: 0603; JLCPCB Part Class: Basic Part; Datasheet: https://item.szlcsc.com/datasheet/0603WAF2701T5E/13814.html; Supplier: LCSC; Type: Thick Film Resistor; Tolerance: ±1%; Power(Watts): 100mW; Voltage-Supply(Max): 75V; Temperature Coefficient: ±100ppm/℃; Operating Temperature: -55℃~+155℃
R39 R92 = 0402WGF5102TCE: Type:Thick Film Resistors Resistance:51kΩ Tolerance:±1% Tolerance:±1% Power(Watts): Overload Voltage (Max): Temperature Coefficient:±100ppm/℃ Temperature Coefficient:±100ppm/℃ Operating Temperature Range:-55℃~+155℃ Operating Temperature Range:-55℃~+155℃; LCSC Part Name: 51kΩ ±1% 62.5mW 厚膜电阻; Supplier Part: C25794; Manufacturer: UNI-ROYAL(厚声); Supplier Footprint: 0402; JLCPCB Part Class: Basic Part; Datasheet: https://atta.szlcsc.com/upload/public/pdf/source/20200306/C422600_1E6D84923E4A46A82E41ADD87F860B5C.pdf; Supplier: LCSC; Type: Thick Film Resistors; Tolerance: ±1%; Temperature Coefficient: ±100ppm/℃; Operating Temperature Range: -55℃~+155℃
U2 U23 U26 = TLV9061IDBVR: Number of Channels:1 Maximum Power Supply Range (Vdd-Vss):9V Rail to Rail:- Gain Bandwidth Product:- Vos - Input Offset Voltage:1.6mV Input Offset Voltage Drift(Vos TC):0.53uV/℃ Slew Rate:55V/us Ib - Input Bias Current:0.5pA Input Offset Current(Ios):- No; LCSC Part Name: 适用于成本敏感型系统的10MHz、轨到轨输入输出（RRIO）CMOS运算放大器; Supplier Part: C398358; Manufacturer: TI(德州仪器); Supplier Footprint: SOT-23-5; JLCPCB Part Class: Extended Part; Datasheet: https://www.ti.com/cn/lit/gpn/tlv9061; Supplier: LCSC; Number of Channels: 1; Maximum Power Supply Range (Vdd-Vss): 9V; Vos - Input Offset Voltage: ±0.3 mV; Input Offset Voltage Drift(Vos TC): 0.53uV/℃; Slew Rate: 55V/us; Ib - Input Bias Current: 0.5pA; Noise density(eN): 10nV/√Hz@1kHz; Common Mode Rejection Ratio(CMRR): 103dB; Operating Temperature: -40℃~+125℃; Single supply: 1.8V~5.5V
U20 U22 U25 U28 = LKS523: Driven Configuration:Half-Bridge Load Type:MOSFET；IGBT Number of Drivers:2 Voltage - Supply:10V~20V Voltage - Supply:10V~20V Rise Time:160ns Fall Time:40ns Propagation Delay tpLH:250ns Features:Under Voltage Protection Operating Temperature:-40℃~+150℃ Ope; LCSC Part Name: 600V半桥预驱动器; Supplier Part: C6337451; Manufacturer: LINKOSEMI(凌鸥创芯); Supplier Footprint: SOP-8; JLCPCB Part Class: Extended Part; Datasheet: https://item.szlcsc.com/datasheet/LKS523/7286042.html; Supplier: LCSC; Driven Configuration: Half-Bridge; Load Type: MOSFET；IGBT; Number of Drivers: 2; Voltage - Supply: 10V~20V; Rise Time: 160ns; Fall Time: 40ns; Propagation Delay tpLH: 250ns; Features: Under Voltage Protection; Operating Temperature: -40℃~+150℃; Input Logic Level - High: 2.4V~10V
V1-V3 = Mechanical_Fiducial
C54 C109 = 0603CG680J500NT: Capacitance:68pF Tolerance:±5% Tolerance:±5% Voltage Rating:50V Temperature Coefficient:C0G; LCSC Part Name: 68pF ±5% 50V; Supplier Part: C1680; Manufacturer: FH(风华); Supplier Footprint: 0603; JLCPCB Part Class: Extended Part; Datasheet: https://item.szlcsc.com/datasheet/0603CG680J500NT/2032.html; Supplier: LCSC; Tolerance: ±5%; Voltage Rating: 50V; Temperature Coefficient: C0G
C55 C107 = CL21A476MQYNNNE: Capacitance:47uF Tolerance:±20% Tolerance:±20% Voltage Rating:6.3V Temperature Coefficient:X5R; LCSC Part Name: 47uF ±20% 6.3V; Supplier Part: C16780; Manufacturer: SAMSUNG(三星); Supplier Footprint: 0805; JLCPCB Part Class: Basic Part; Datasheet: https://item.szlcsc.com/datasheet/CL21A476MQYNNNE/17464.html; Supplier: LCSC; Tolerance: ±20%; Voltage Rating: 6.3V; Temperature Coefficient: X5R
C110-C113 = RVT1V471M1010: Capacitance: Tolerance:±20% Tolerance:±20% Rated Voltage: Ripple Current:- Equivalent Series Resistance(ESR):- φD: L: Lifetime @ Temp:2000hrs@105℃ Operating Temperature:-55℃~+105℃ Operating Temperature:-55℃~+105℃; LCSC Part Name: 470uF ±20% 35V; Supplier Part: C3350; Manufacturer: HONOR(荣誉); Supplier Footprint: SMD,D10xL10.2mm; JLCPCB Part Class: Extended Part; Datasheet: https://atta.szlcsc.com/upload/public/pdf/source/20210521/C113284_25C86AE95FB541053FE695F13EA8E7D0.pdf; Supplier: LCSC; Tolerance: ±20%; Rated Voltage: 35V; Lifetime @ Temp: 2000hrs@105℃; Operating Temperature: -55℃~+105℃
D1 = SMBJ24CA_C78416: Reverse Stand-Off Voltage (Vrwm):24V Maximum Clamping Voltage:38.9V Peak Pulse Current (Ipp):15.5A Breakdown Voltage:26.7V Type:TVS; LCSC Part Name: 24V截止 15.5A峰值脉冲; Supplier Part: C78416; Manufacturer: Brightking(君耀电子); Supplier Footprint: SMB(DO-214AA); JLCPCB Part Class: Extended Part; Datasheet: https://atta.szlcsc.com/upload/public/pdf/source/20181127/C309995_EB3DFB9F9AEE5D2146ECD9FA5992A402.pdf; Supplier: LCSC; Reverse Stand-Off Voltage (Vrwm): 24V; Maximum Clamping Voltage: 38.9V; Peak Pulse Current (Ipp): 15.5A; Breakdown Voltage: 26.7V; Type: TVS
L1 = SWPA6045S120MT: Inductance:12uH Tolerance:±20% Tolerance:±20% Current Rating:2.2A Current - Saturation(Isat):2.8A DC Resistance(DCR):58mΩ Type:- Ratings:-; LCSC Part Name: 12uH ±20% 2.8A; Supplier Part: C96951; Manufacturer: Sunlord(顺络); Supplier Footprint: SMD,6x6mm; JLCPCB Part Class: Extended Part; Datasheet: https://item.szlcsc.com/datasheet/SWPA6045S120MT/98156.html; Supplier: LCSC; Tolerance: ±20%; Current Rating: 2.2A; Current - Saturation(Isat): 2.8A; DC Resistance(DCR): 58mΩ
L2 = SWPA5040S6R8MT: Inductance: Tolerance:±20% Tolerance:±20% Rated Current: Saturation Current (Isat):2.9A DC Resistance (DCR): Type:- Ratings:-; LCSC Part Name: 6.8uH ±20% 2.9A; Supplier Part: C36411; Manufacturer: Sunlord(顺络); Supplier Footprint: SMD; JLCPCB Part Class: Extended Part; Datasheet: https://atta.szlcsc.com/upload/public/pdf/source/20231024/317626D2AA2F8AB4113C1875E432E6E1.pdf; Supplier: LCSC; Tolerance: ±20%; Rated Current: 2.5A; Saturation Current (Isat): 2.9A
U12 U29 = TPS54302DDCT: Function:Step-down type Output Type:Adjustable Input Voltage:4.5V~28V Input Voltage:4.5V~28V Output Voltage:596mV~28V Output Voltage:596mV~28V Output Current:3A Switching Frequency:400kHz Switching Frequency:400kHz Operating Temperature:-40℃~+125℃@(TJ) Op; LCSC Part Name: 4.5V至28V输入,3A输出,低EMI同步降压转换器; Supplier Part: C129370; Manufacturer: TI(德州仪器); Supplier Footprint: TSOT-23-6; JLCPCB Part Class: Extended Part; Datasheet: https://www.ti.com/cn/lit/gpn/tps54302; Supplier: LCSC; Function: Step-down type; Output Type: Adjustable; Input Voltage: 4.5V~28V; Output Voltage: 596mV~28V; Output Current: 3A; Switching Frequency: 400kHz; Operating Temperature: -40℃~+125℃@(TJ); Synchronous Rectification: Yes; Number of Outputs: 1; Topology: Step-down; Switch tube (built-in/external): Built-in

## Nets
3V3: C54.2 C55.2 C107.2 C146.2 C147.2 C152.2 C155.2 C156.2 C157.2 C158.2 C159.2 C160.2 C161.2 C162.2 C163.2 J8.5 L2.2 LED9.2(A) LED10.2(A) LED11.2(A) LED12.2(A) LED13.2(A) LED14.2(A) R80.2 R82.2 R83.2 R84.2 R99.2 R102.2 R103.2 R104.2 R105.2 R116.2 U2.5(V+) U5.1(VDD5V) U5.2(VDD3V3) U5.5(PGO) U6.8(VCC) U7.8(VCC) U15.1(VBAT) U15.16(VDD) U15.28(VREF+) U15.29(VDDA) U15.32(VDD) U15.48(VDD) U15.64(VDD) U16.8(VCC) U23.5(V+) U26.5(V+)
12V: C109.2 C118.2 C119.2 C120.2 C121.2 C122.2 C123.2 C124.2 C125.2 C139.2 C144.2 C148.2 C153.2 D3.2(A) D4.2(A) D5.2(A) D6.2(A) L1.2 R39.2 U20.1(VCC) U22.1(VCC) U25.1(VCC) U28.1(VCC)
24V: C9.2 C96.2 C97.2 C98.2 C100.2 C110.1 C111.1 C112.1 C113.1 D1.1(K) D7.1(K) J4.1 J4.2 J4.3 J4.4 Q1.2(D) Q7.2(D) Q9.2(D) R69.2 R70.2 R92.2 U12.3(VIN) U29.3(VIN)
GND: C4.1 C9.1 C43.1 C46.1 C47.1 C55.1 C96.1 C97.1 C98.1 C100.1 C107.1 C110.2 C111.2 C112.2 C113.2 C116.1 C117.1 C118.1 C119.1 C120.1 C121.1 C122.1 C123.1 C124.1 C125.1 C126.1 C139.1 C144.1 C146.1 C147.1 C148.1 C152.1 C153.1 C155.1 C156.1 C157.1 C158.1 C159.1 C160.1 C161.1 C162.1 C163.1 C164.1 D1.2(A) J5.1 J5.2 J5.3 J5.4 J6.3 J7.3 J8.1 J9.2 LED1.1(K) LED2.1(K) LED3.1(K) LED4.1(K) LED5.1(K) LED6.1(K) LED7.1(K) LED8.1(K) LED15.1(K) LED16.1(K) LED17.1(K) LED18.1(K) Q12.3(S) R1.1 R6.2 R31.1 R45.2 R47.1 R52.2 R54.1 R81.1 R86.2 R88.2 R90.2 R93.1 R97.2 R100.1 R101.1 R106.1 U2.2(V-) U5.4(GND) U5.8(DIR) U6.5(GND) U7.5(GND) U12.1(GND) U15.15(VSS) U15.27(VSSA) U15.31(VSS) U15.47(VSS) U15.63(VSS) U16.1(A0) U16.2(A1) U16.3(A2) U16.4(VSS) U16.7(#WC) U20.4(COM) U22.4(COM) U23.2(V-) U25.4(COM) U26.2(V-) U28.4(COM) U29.1(GND) X1.2(GND) X1.4(GND)
1_485_A: J6.2 U6.6(A)
1_485_B: J6.1 U6.7(B)
2_485_A: J7.2 U7.6(A)
2_485_B: J7.1 U7.7(B)
CURR_A: C43.2 R94.1 U15.12(PA0)
CURR_B: C116.2 R95.1 U15.13(PA1)
CURR_C: C117.2 R96.1 U15.14(PA2)
DEBUG_RX: J9.3 R116.1 R121.1 U15.53(PC11)
DEBUG_TX: J9.4 R122.1 U15.52(PC10)
INBRAKE: R98.1 R123.1 U15.20(PA6)
INHA: R124.1 U15.8(PC0) U20.2(HIN)
INHB: R125.1 U15.9(PC1) U22.2(HIN)
INHC: R126.1 U15.10(PC2) U25.2(HIN)
INLA: U15.2(PC13) U20.3(LIN)
INLB: U15.24(PB0) U22.3(LIN)
INLC: U15.25(PB1) U25.3(LIN)
NRST: C164.2 J8.2 R99.1 U15.7(PG10-NRST)
OUT_A: C151.1 J1.1 J1.2 J1.3 J1.4 Q1.3(S) Q2.2(D) U20.6(VS)
OUT_B: C143.1 J2.1 J2.2 J2.3 J2.4 Q7.3(S) Q8.2(D) U22.6(VS)
OUT_BRAKE: C154.1 D7.2(A) Q12.2(D) R69.1 R70.1 U28.6(VS)
OUT_C: C145.1 J3.1 J3.2 J3.3 J3.4 Q9.3(S) Q10.2(D) U25.6(VS)
SUPPLY_ADC: C126.2 R91.2 R92.1 U15.17(PA3)
SWCLK: J8.4 U15.50(PA14)
SWDIO: J8.3 U15.49(PA13)
$1N1999: Q2.3(S) R1.2 R85.2
$1N2053: R5.1 R86.1 U2.4(IN-)
$1N2445: R6.1 R82.1 R85.1 U2.3(IN+)
$1N86489: C151.2 D3.1(K) U20.8(VB)
$1N91606: R71.1 U20.7(HO)
$1N91630: R72.1 U20.5(LO)
$1N91671: Q1.1(G) R71.2
$1N91711: Q2.1(G) R72.2
$1N98362: Q8.3(S) R47.2 R87.2
$1N98363: R44.1 R88.1 U23.4(IN-)
$1N98364: R45.1 R83.1 R87.1 U23.3(IN+)
$1N98377: C143.2 D4.1(K) U22.8(VB)
$1N98378: R73.1 U22.7(HO)
$1N98379: R74.1 U22.5(LO)
$1N98380: Q7.1(G) R73.2
$1N98381: Q8.1(G) R74.2
$1N98383: R44.2 R95.2 U23.1(OUT)
$1N99332: Q10.3(S) R54.2 R89.2
$1N99333: R51.1 R90.1 U26.4(IN-)
$1N99334: R52.1 R84.1 R89.1 U26.3(IN+)
$1N99347: C145.2 D5.1(K) U25.8(VB)
$1N99348: R75.1 U25.7(HO)
$1N99349: R76.1 U25.5(LO)
$1N99350: Q9.1(G) R75.2
$1N99351: Q10.1(G) R76.2
$1N99353: R51.2 R96.2 U26.1(OUT)
$1N100317: C154.2 D6.1(K) U28.8(VB)
$1N100319: R77.1 U28.5(LO)
$1N100321: Q12.1(G) R77.2
$1N100324: R97.1 U28.2(HIN)
$1N106583: R91.1 R93.2
$1N106649: R5.2 R94.2 U2.1(OUT)
$1N106964: R98.2 U28.3(LIN)
$2N1335: C138.1 L1.1 U12.2(SW)
$2N1336: C109.1 R31.2 R39.1 U12.4(FB)
$2N1343: C138.2 U12.6(BOOT)
$2N8525: C137.1 L2.1 U29.2(SW)
$2N8526: C54.1 R80.1 R81.2 U29.4(FB)
$2N8532: C137.2 U29.6(BOOT)
$3N1136: R107.1 U5.3(OUT)
$3N1142: R102.1 U15.43(PA9) U16.6(SCL)
$3N1151: R103.1 U15.42(PA8) U16.5(SDA)
$3N1659: C46.2 U15.6(PF1-OSC_OUT) X1.3(OSC2)
$3N1660: C47.2 U15.5(PF0-OSC_IN) X1.1(OSC1)
$3N1664: R106.2 U15.61(PB8-BOOT0)
$3N11685: C4.2 R107.2 U15.34(PB12)
$3N12926: R104.1 U5.7(SCL) U15.40(PC8)
$3N12927: R105.1 U5.6(SDA) U15.41(PC9)
$3N23039: R118.1 U6.1(RO) U15.22(PC4)
$3N23065: R120.1 U7.1(RO) U15.30(PB10)
$3N23090: R119.1 U7.4(DI) U15.33(PB11)
$3N26572: LED1.2(A) R108.2
$3N26583: R108.1 U15.26(PB2)
$3N27118: LED2.2(A) R109.2
$3N27200: LED3.2(A) R110.2
$3N27282: LED4.2(A) R111.2
$3N27364: LED5.2(A) R112.2
$3N27446: LED6.2(A) R113.2
$3N27528: LED7.2(A) R114.2
$3N27610: LED8.2(A) R115.2
$3N27616: R109.1 U15.56(PB3)
$3N27622: R110.1 U15.57(PB4)
$3N27629: R111.1 U15.58(PB5)
$3N27636: R112.1 U15.59(PB6)
$3N27643: R113.1 U15.60(PB7)
$3N27650: R114.1 U15.62(PB9)
$3N27657: R115.1 U15.35(PB13)
$3N32995: LED10.1(K) R118.2
$3N32999: LED9.1(K) R117.2
$3N33393: LED11.1(K) R119.2
$3N33395: LED12.1(K) R120.2
$3N33436: R100.2 U7.2(RE#) U7.3(DE) U15.36(PB14)
$3N35723: LED14.1(K) R122.2
$3N35726: LED13.1(K) R121.2
$3N35910: LED15.2(A) R123.2
$3N38475: LED16.2(A) R124.2
$3N38556: LED17.2(A) R125.2
$3N38641: LED18.2(A) R126.2
$3N45407: R117.1 U6.4(DI) U15.23(PC5)
$3N45415: R101.2 U6.2(RE#) U6.3(DE) U15.46(PA12)

Not connected (* = marked no-connect by the designer): J9 1* 5* 6*; U12 5(EN)*; U15 3(PC14-OSC32_IN)* 4(PC15-OSC32_OUT)* 11(PC3)* 18(PA4)* 19(PA5)* 21(PA7)* 37(PB15)* 38(PC6)* 39(PC7)* 44(PA10)* 45(PA11)* 51(PA15)* 54(PC12)* 55(PD2)*; U28 7(HO)*; U29 5(EN)*

## Notes on the sheets
sheet 1
- @3.3V (ADC max) => 31.353V
  -3db @29.5kHz
- -3db @48.5kHz
- series resistor for
  engineering
- Errata:
- 10MOhm (R83) must be 100kOhm
  100kOhm on negative side (R44) must be 47kOhm
  => this lets measure negative freewheeling currents
  when ARR=0 (timer update, all 3 low side FET ON) take
  ADC measurement and get full 3 phase current data in one
  shot.
sheet 2
- 24V
- Parameters:
  vin = 16 - 28V
  iout = 0.35A
  uout = 12V
  => 10.8-18.5uH max 500mOhm, 1.9-6A, 680nF in, 45uF out
- 26V max
  D1 breaks down at 26.7V DC-DC max out at 28V
- theoretical 11.85V
- FB=0.596V
- Parameters:
  vin = 16 - 28V
  iout = 0.15A
  uout = 3.3V
  => 4.6-7.8uH, max 140mOhm, 1.9-6A, 1uF in, 100uF out
- theoretical 3.305V
- FB=0.596V
sheet 3
- 7bit Address = 0x80
- Write operations are enabled when
  Write Control (WC) is either
  driven low or left floating.
- 3V3
- DTR
- RXI
- GND
- TXD
- 5V
